# Altium schematic sheet Sheet1_Lab08.SchDoc: Lab 08 Mesh Analysis Circuit
size 223 x 172 mm; DrawnBy: Abigail Joseph; Revision: A1; SheetNumber: 1; SheetTotal: 2
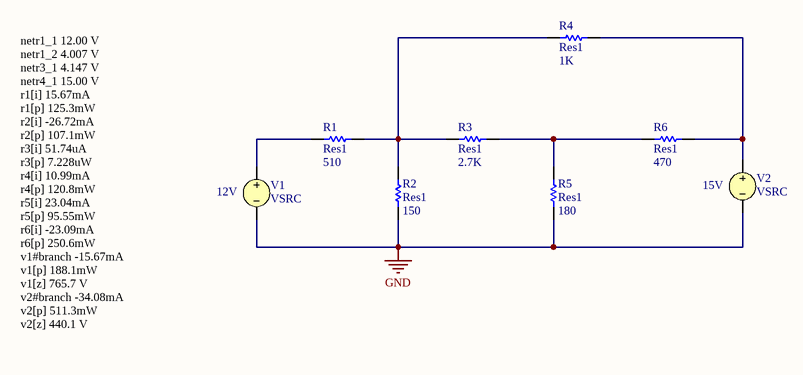
[diagram p0: Sheet1_Lab08.SchDoc]

## Parts
R1  Res1  value 510  [AXIAL-0.3]
R2  Res1  value 150  [AXIAL-0.3]
R3  Res1  value 2.7K  [AXIAL-0.3]
R4  Res1  value 1K  [AXIAL-0.3]
R5  Res1  value 180  [AXIAL-0.3]
R6  Res1  value 470  [AXIAL-0.3]
V1  VSRC  value 12V
V2  VSRC  value 15V

## Nets
GND: R2.1 R5.2 V1.2 V2.2
NetR1_1: R1.1 V1.1
NetR1_2: R1.2 R2.2 R3.2 R4.2
NetR3_1: R3.1 R5.1 R6.1
NetR4_1: R4.1 R6.2 V2.1

## Notes on the sheet
- netr1_1	12.00 V
  netr1_2	4.007 V
  netr3_1	4.147 V
  netr4_1	15.00 V
  r1[i]	15.67mA
  r1[p]	125.3mW
  r2[i]	-26.72mA
  r2[p]	107.1mW
  r3[i]	51.74uA
  r3[p]	7.228uW
  r4[i]	10.99mA
  r4[p]	120.8mW
  r5[i]	23.04mA
  r5[p]	95.55mW
  r6[i]	-23.09mA
  r6[p]	250.6mW
  v1#branch	-15.67mA
  v1[p]	188.1mW
  v1[z]	765.7 V
  v2#branch	-34.08mA
  v2[p]	511.3mW
  v2[z]	440.1 V
- Drawn by:
- Date:
- Revision:
- Sheet
- of
- File:
- Size:
- 0.8*Letter
- School of Engineering & Computer Science

## Library data of the parts
R1-R6 = Res1: Resistor; Published: 8-Jun-2000; LatestRevisionDate: 17-Jul-2002; LatestRevisionNote: Re-released for DXP Platform.; PackageReference: AXIAL-0.3; Publisher: Altium Limited; PackageDescription: Axial Device, Thru-Hole; 2 Leads; 0.3 in Pin Spacing
V1 V2 = VSRC: Voltage Source; Note: PCB Footprint - Not required; Published: 8-Jun-2000; LatestRevisionDate: 17-Jul-2002; LatestRevisionNote: Re-released for DXP Platform.; PackageReference: Not Applicable; Publisher: Altium Limited